# Altium schematic sheet zp_zh.SchDoc
size OrCAD A
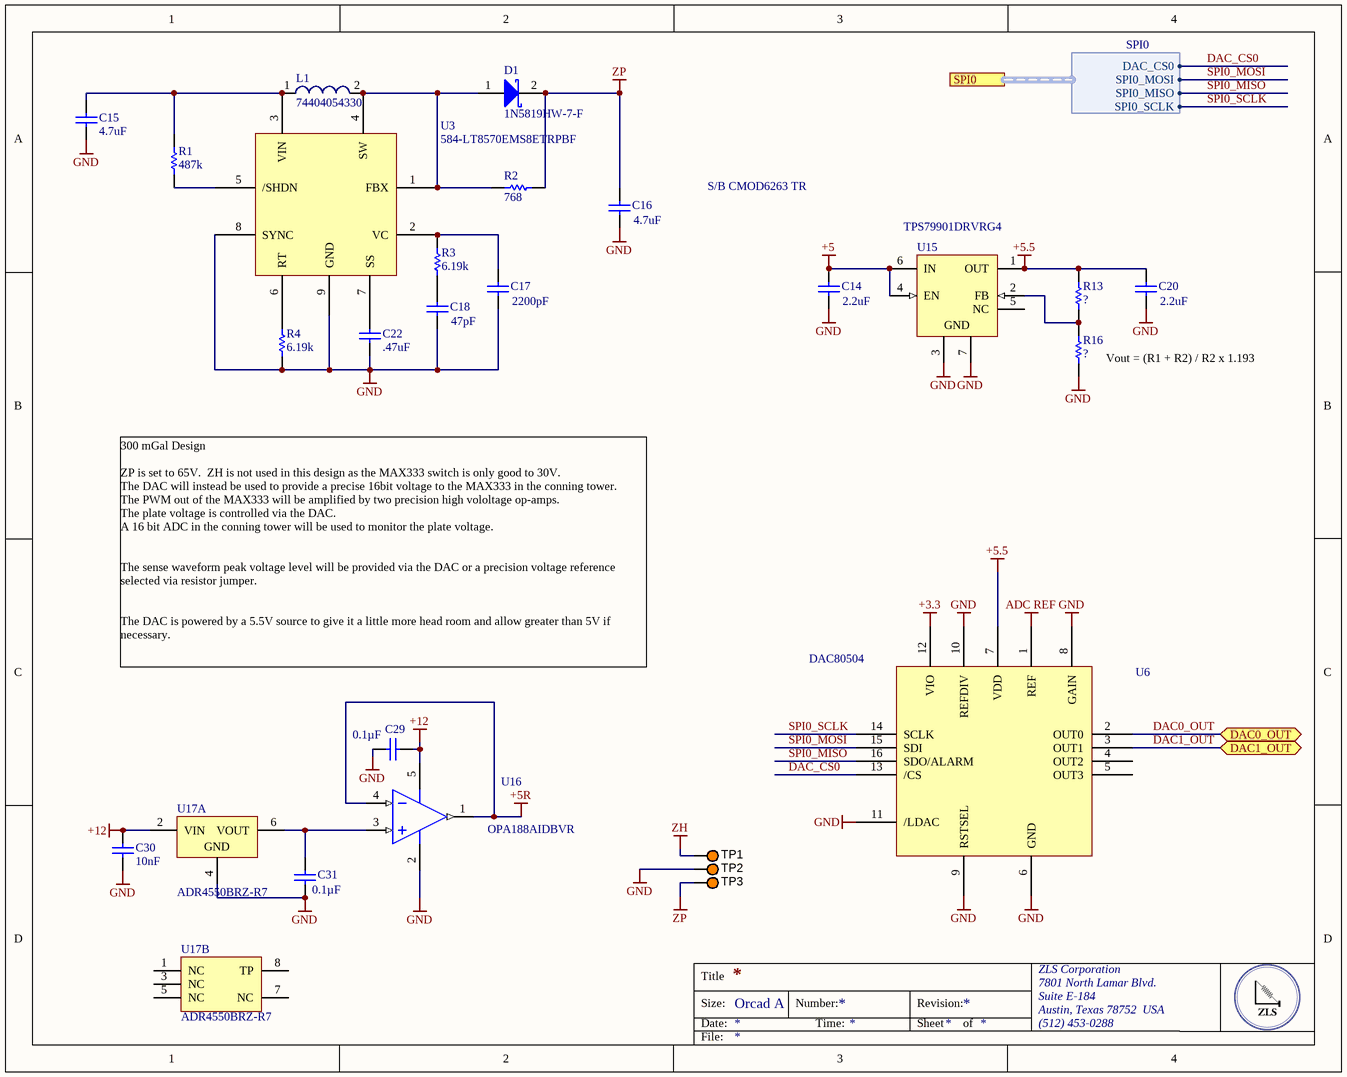
[diagram p0: zp_zh.SchDoc]

## Parts
C14  Capacitance: 2.2uF  [CAPC0805(2012)155_L]  (hidden comment: CAP CER 1UF 25V X7R 0805)
C15  4.7uF  [CAPC0805(2012)155_L]
C16  Capacitance: 4.7uF  [CAPC0805(2012)155_L]  (hidden comment: CAP CER 1UF 25V X7R 0805)
C17  Capacitance: 2200pF  [CAPC0805(2012)155_L]  (hidden comment: CAP CER 1UF 25V X7R 0805)
C18  Capacitance: 47pF  [CAPC0805(2012)155_L]  (hidden comment: CAP CER 1UF 25V X7R 0805)
C20  Capacitance: 2.2uF  [CAPC0805(2012)155_L]  (hidden comment: CAP CER 1UF 25V X7R 0805)
C22  .47uF  [CAPC0805(2012)155_L]
C29  Capacitance: 0.1µF  [CAPC0805(2012)145_N]  (hidden comment: CAP CER 0.1UF 25V X7R 0805)
C30  Capacitance: 10nF  [CAPC0805(2012)145_N]  (hidden comment: Multilayer Ceramic Capacitors MLCC - SMD/SMT 0.01uF 50volts 10% X7R)
C31  Capacitance: 0.1µF  [CAPC0805(2012)145_N]  (hidden comment: CAP CER 0.1UF 25V X7R 0805)
D1  1N5819HW-7-F  [DIOD-SOD-123-2_V]
L1  74404054330  [WE-LQS 5040]
R1  487k  [RESC0805(2012)_L]
R2  768  [RESC0805(2012)_L]
R3  6.19k  [RESC0805(2012)_L]
R4  6.19k  [RESC0805(2012)_L]
R13  ?  [RESC0805(2012)_L]
R16  ?  [RESC0805(2012)_L]
TP1  5003  [KSTN-5003]  (value not drawn)
TP2  5003  [KSTN-5003]  (value not drawn)
TP3  5003  [KSTN-5003]  (value not drawn)
U3  Supplier Part Number 1: 584-LT8570EMS8ETRPBF  [LT8570-MSOP]  (hidden comment: LT8570)
U6  DAC80504  [DAC80504]
U15  TPS79901DRVRG4  [TI-DRV6-1600X1000TP_V]
U16  OPA188AIDBVR  [DBV0005A_M]
U17  ADR4550BRZ-R7  [ADI-R-8_M]  (parts A,B of 2)

## Ports
DAC0_OUT, DAC1_OUT, SPI0 (harness SPI0)

## Harnesses
SPI0: DAC_CS0, SPI0_MOSI, SPI0_MISO, SPI0_SCLK

## Nets
+3.3: U6.12(VIO)
+5: C14.2 U15.4(EN) U15.6(IN)
+5.5: C20.2 R13.1 U6.7(VDD) U15.1(OUT)
+5R: U16.1(OUT) U16.4(IN-)
+12: C29.2 C30.1 U16.5(V+) U17.2(VIN)
ADC REF: U6.1(REF)
GND: C14.1 C15.1 C16.1 C17.1 C18.1 C20.1 C22.1 C29.1 C30.2 C31.2 R4.2 R16.2 TP2.1 U3.8(SYNC) U3.9(GND) U6.6(GND) U6.8(GAIN) U6.9(RSTSEL) U6.10(REFDIV) U6.11(/LDAC) U15.3(GND) U15.7(GND) U16.2(V-) U17.4(GND)
ZH: TP1.1
ZP: C16.2 D1.2(K) R2.1 TP3.1
DAC0_OUT: U6.2(OUT0) ; port DAC0_OUT
DAC1_OUT: U6.3(OUT1) ; port DAC1_OUT
DAC_CS0: U6.13(/CS) ; port SPI0.DAC_CS0
SPI0_MISO: U6.16(SDO/ALARM) ; port SPI0.SPI0_MISO
SPI0_MOSI: U6.15(SDI) ; port SPI0.SPI0_MOSI
SPI0_SCLK: U6.14(SCLK) ; port SPI0.SPI0_SCLK
NetC15_2: C15.2 L1.1 R1.1 U3.3(VIN)
NetC17_2: C17.2 R3.1 U3.2(VC)
NetC18_2: C18.2 R3.2
NetC22_2: C22.2 U3.7(SS)
NetC31_1: C31.1 U16.3(IN+) U17.6(VOUT)
NetD1_1: D1.1(A) L1.2 R2.2 U3.1(FBX) U3.4(SW)
NetR1_2: R1.2 U3.5(/SHDN)
NetR4_1: R4.1 U3.6(RT)
NetR13_2: R13.2 R16.1 U15.2(FB)

Not connected (* = marked no-connect by the designer): U6 4(OUT2) 5(OUT3); U15 5(NC); U17 1(NC) 3(NC) 5(NC) 7(NC) 8(TP)

## Notes on the sheet
- S/B CMOD6263 TR
- (near R16) Vout = (R1 + R2) / R2 x 1.193
- 300 mGal Design
  ZP is set to 65V.  ZH is not used in this design as the MAX333 switch is only good to 30V.
  The DAC will instead be used to provide a precise 16bit voltage to the MAX333 in the conning tower.
  The PWM out of the MAX333 will be amplified by two precision high vololtage op-amps.
  The plate voltage is controlled via the DAC.
  A 16 bit ADC in the conning tower will be used to monitor the plate voltage.
  The sense waveform peak voltage level will be provided via the DAC or a precision voltage reference selected via resistor jumper.
  The DAC is powered by a 5.5V source to give it a little more head room and allow greater than 5V if necessary.
- Title
- Size:
- Date:
- Orcad A
- Number:
- Time:
- Revision:
- Sheet
- of
- ZLS Corporation
- 7801 North Lamar Blvd.
- Suite E-184
- Austin, Texas 78752  USA
- (512) 453-0288
- File:

## Library data of the parts
C14 C16-C18 C20 = CMP-1036-04882-1: Manufacturer: Murata Electronics North America; Manufacturer Part Number: GRM21BR71E105KA99L; Tolerance: ±10%; Supplier 1: Digi-Key; Supplier Part Number 1: 490-6484-6-ND; RoHS: RoHS Compliant; Category: Capacitors; Stock 1: 295074; Pricing 1: 1=0.14, 10=0.099, 100=0.0468, 500=0.0328, 1000=0.02715 (USD); Packaging: Digi-Reel®; Part Status: Active; Voltage - Rated: 25V; Temperature Coefficient: X7R; Operating Temperature: -55°C ~ 125°C; Features: -; Ratings: -; Applications: General Purpose; Mounting Type: Surface Mount, MLCC; Package / Case: 0805 (2012 Metric); Size / Dimension: 0.079" L x 0.049" W (2.00mm x 1.25mm); Height - Seated (Max): -; Thickness (Max): 0.053" (1.35mm); Lead Spacing: -; Lead Style: -; ComponentLink1URL: http://www.murata.com/~/media/webrenewal/support/library/catalog/products/capacitor/mlcc/c02e.ashx; ComponentLink1Description: http://www.murata.com/~/media/webrenewal/support/library/catalog/products/capacitor/mlcc/c02e.ashx
C15 C22 = CMP-1036-04882-1
C29 C31 = CMP-1036-04795-1: Manufacturer: Murata Electronics North America; Manufacturer Part Number: GRM21BR71E104KA01L; Tolerance: ±10%; Supplier 1: Digi-Key; Supplier Part Number 1: 490-1673-6-ND; RoHS: RoHS Compliant; Category: Capacitors; Stock 1: 891652; Pricing 1: 1=0.2, 10=0.145, 100=0.0683, 500=0.04788, 1000=0.03964 (USD); Packaging: Digi-Reel®; Part Status: Active; Voltage - Rated: 25V; Temperature Coefficient: X7R; Operating Temperature: -55°C ~ 125°C; Features: -; Ratings: -; Applications: General Purpose; Mounting Type: Surface Mount, MLCC; Package / Case: 0805 (2012 Metric); Size / Dimension: 0.079" L x 0.049" W (2.00mm x 1.25mm); Height - Seated (Max): -; Thickness (Max): 0.053" (1.35mm); Lead Spacing: -; Lead Style: -; ComponentLink1URL: http://www.murata.com/~/media/webrenewal/support/library/catalog/products/capacitor/mlcc/c02e.ashx; ComponentLink1Description: http://www.murata.com/~/media/webrenewal/support/library/catalog/products/capacitor/mlcc/c02e.ashx
C30 = CMP-1036-04795-1: Manufacturer: Kemet; Manufacturer Part Number: C0805C103K5RACAUTO; Voltage Rating: 50V; Supplier 1: Digi-Key; Supplier Part Number 1: 399-6924-1-ND; Stock 1: 63236; Pricing 1: 1=0.12, 10=0.087, 100=0.041, 500=0.0287, 1000=0.0238 (USD); Mount: Surface Mount; Case/Package: 0805; Case Code (Metric): 2012; Case Code (Imperial): 0805; Dielectric Material: Ceramic; Contact Plating: Tin; Min Operating Temperature: -55°C; Max Operating Temperature: 125°C; Tolerance: 10%; Packaging: Tape and Reel; Package Quantity: 1; Voltage Rating (DC): 50V; Dielectric: X7R; Termination: SMD/SMT; Length: 2mm; Height: 0.78mm; Width: 0.049inch; Thickness: 0.035inch; Depth: 1.25mm; Radiation Hardening: No; REACH SVHC: No SVHC; ComponentLink1URL: https://datasheet.ciiva.com/22700/1693454-22700519.pdf; ComponentLink1Description: https://datasheet.ciiva.com/22700/1693454-22700519.pdf; ComponentLink2URL: https://datasheet.ciiva.com/7842/1693454-7842175.pdf; ComponentLink2Description: https://datasheet.ciiva.com/7842/1693454-7842175.pdf
D1 = CMP-0303-00003-1: 1.0 A Surface Mount Schottky Barrier Rectifier, 40 V, -65 to 125 degC, 2-Pin SOD-123 Package, RoHS, Tape and Reel; Manufacturer: Diodes Inc; @ VR (V): 40; @ Terminal Temperature TT (degC): 90; Maximum Average Rectified Current IO (A): 1; Total Capacitance CT (pF): 50; Peak Forward Surge Current IFSM (A): 25; Forward Voltage Drop VF (V): 0.45; VR (RMS) (V): 28; RoHS: TRUE; PartNumber: 1N5819HW-7-F; ComponentLink2URL: http://www.diodes.com/datasheets/ds30217.pdf; PackageDescription: 2-Pin SOD-123, Body 2.7 x 1.55 mm, Pitch 3.7 mm; @ IF (A): 1; Operating and Storage Temperature Range: -65 to 125 degC; ComponentLink1Description: Manufacturer URL; ComponentLink2Description: Datasheet; ComponentLink1URL: http://www.diodes.com/; Mounting Technology: Surface Mount; DatasheetVersion: Rev. 15-2; PackageReference: SOD-123-2; Maximum Reverse Current IR (uA): 50; Peak Repetitive Reverse Voltage VRRM (V): 40; Packing: Tape and Reel
L1 = CMP-1354-00041-1: WE-LQS SMD Power Inductor, L=33.0 µH; Manufacturer: Wuerth Elektronik; Inductance: 33.0 ÂµH; PackageReference: WE-LQS 5040; ComponentLink1URL: http://www.we-online.com; ComponentLink2URL: http://katalog.we-online.de/pbs/datasheet/74404054330.pdf; ComponentLink2Description: Datasheet; PartNumber: 74404054330; ComponentLink1Description: Manufacturer URL
R1-R4 R13 R16 = CMP-1013-00215-1
TP1-TP3 = CMP-1672-00009-1: Test Point, Orange, 1-Pin THD, RoHS; Peak Reverse Current: 600 uA; Forward Current: 3 A; Max Surge Current: 80 A; Forward Voltage: 1.08 V; Max Operating Temperature: 150 degC; PackageReference: 5003; Pins: 2; ComponentLink2URL: http://keyelco.com/userAssets/file/M65p56.pdf; PackageDescription: 1-Pin Through Hole Device, Dia 2.54 mm; Weight: 0.01 lb; Diameter: 5.3 mm; Mount: Through Hole; Package Quantity: 500; Packaging: Bulk; Min Operating Temperature: -65 degC; ComponentLink1Description: Manufacturer URL; Height: 0.25 inch; ComponentLink1URL: http://www.keyelco.com/; ComponentLink2Description: Datasheet; Width: 0.25 inch; REACH SVHC: No SVHC; RoHSCompliant: true; Radiation Hardening: No; Length: 9.5 mm; DatasheetVersion: Jun-15
U3 = LT8570: IC REG MULT CONFIG INV ADJ 8MSOP; Supplier 1: Mouser
U15 = CMP-0394-01371-1: Single Output High PSRR LDO, 200 mA, Adjustable 1.2 to 6.5 V Output, 2.7 to 6.5 V Input, with Low IQ, 6-pin SON (DRV), -40 to 85 degC, Green (RoHS & no Sb/Br); Manufacturer: Texas Instruments; Vin(Max)(V): 6.5; Vin(Min)(V): 2.7; Iout(Max)(A): 0.2; Vout Adj(Min)(V): 1.2; Iq(Typ)(mA): 0.04; Rating: Catalog; Vdo(Typ)(mV): 90; SubFamily: Single Channel LDO; Accuracy(%): 2; ComponentLink4Description: URL Link1; PartNumber: TPS79901DRVRG4; ComponentLink4URL: Samples URL:http://www.ti.com/product/tps79901#samples; ComponentLink1Description: Manufacturer URL; ComponentLink3Description: Package Specification; PackageVersion: 4206925/E; PackageReference: DRV6-1600X1000TP; Vout Adj(Max)(V): 6.5; PackageDescription: 6-Pin Plastic Small Outline No-Lead, Body 2 x 2 mm, Pitch 0.65 mm; ComponentLink3URL: http://www.ti.com/litv/pdf/mpds216d; Eco-Plan: Green (RoHS & no Sb/Br); ComponentLink1URL: http://www.ti.com/; ComponentLink2Description: Datasheet; Mounting Technology: Surface Mount; DatasheetVersion: SBVS056J; ComponentLink2URL: http://www.ti.com/general/docs/lit/getliterature.tsp?genericPartNumber=TPS79901&fileType=pdf
U16 = CMP-0809-00005-2: Precision, Low Noise, Rail-to-Rail Output, Zero-Drift Operational Amplifier, 4 to 36 V, -40 to 125 degC, 5-pin SOT23 (DBV5), Green (RoHS & no Sb/Br); Manufacturer: Texas Instruments; Total Supply Voltage(Min)(+5V is 5, +/-5V is 10): 4; Offset Drift(Typ)(uV/C): 0.03; Rating: Catalog; SubFamily: Zero Drift Precision Amplifier; GBW(Typ)(MHz): 2; Slew Rate(Typ)(V/us): 0.8; Number of Channels: 1; CMRR(Min)(dB): 120; Iq per channel(Max)(mA): 0.51; Total Supply Voltage(Max)(+5V is 5, +/-5V is 10): 36; PartNumber: OPA188AIDBVR; ComponentLink2Description: Datasheet; ComponentLink2URL: http://www.ti.com/lit/ds/symlink/opa188.pdf; ComponentLink1Description: Manufacturer URL; Mounting Technology: Surface Mount; Eco-Plan: Green (RoHS & no Sb/Br); ComponentLink1URL: http://www.ti.com/; PackageVersion: 4073253-4/K, 03/2006; DatasheetVersion: SBOS642A; ComponentLink3Description: Package Specification; PackageReference: DBV0005A; ComponentLink3URL: http://www.ti.com/litv/pdf/mpds018i; PackageDescription: 5-Pin Plastic Small Outline, Body 1.6 x 2.9 mm, Pitch 0.95 mm; Code_JEDEC: MO-178
U17 = CMP-0784-00191-1: Ultralow Noise, High Accuracy Voltage Reference, 5 V Output, 3 to 15 V Supply, Industrial, 8-pin SOIC (R-8), Reel; Manufacturer: Analog Devices; Max V Supply (V): 15; Vout: 5V; Ref Out TC (ppm/C): 2; Min V Supply (V): 3; ComponentLink1Description: Manufacturer URL; Mounting Technology: Surface Mount; PackageReference: R-8; ComponentLink2Description: Datasheet; ComponentLink3Description: Package Specification; PackageVersion: 060506-A, 06/2006; PackageDescription: 8-Pin Standard Small Outline Package, Body 4.9 x 3.9 mm, Pitch 1.27 mm; DatasheetVersion: Rev. 0; Packing: Reel; PartNumber: ADR4550BRZ-R7; Operating Temp Range: -40 to 125 degC; ComponentLink4URL: Product URL:http://www.analog.com/en/special-linear-functions/voltage-references/adr4550/products/product.html; Code_JEDEC: MS-012-AA; ComponentLink3URL: http://www.analog.com/static/imported-files/packages/PKG_PDF/SOIC_Narrow%20(R)/R_8.pdf; ComponentLink2URL: http://www.analog.com/static/imported-files/data_sheets/ADR4520_4525_4530_4533_4540_4550.pdf; ComponentLink4Description: URL Link1; ComponentLink1URL: http://www.analog.com/en/index.html; PartId: 1